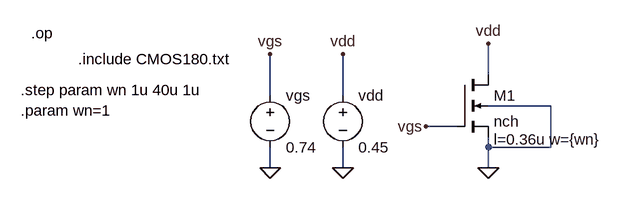
[diagram p0: schematic Draft1.asc]
Draft1.asc, the LTspice schematic file:
Version 4
SHEET 1 880 680
WIRE 208 112 208 64
WIRE -128 144 -128 80
WIRE -16 144 -16 80
WIRE 304 160 208 160
WIRE 160 192 112 192
WIRE 208 224 208 208
WIRE 304 224 304 160
WIRE 304 224 208 224
WIRE -128 256 -128 224
WIRE -16 256 -16 224
WIRE 208 256 208 224
FLAG 208 256 0
FLAG -128 256 0
FLAG -16 256 0
FLAG -128 80 vgs
FLAG -16 80 vdd
FLAG 208 64 vdd
FLAG 112 192 vgs
SYMBOL nmos4 160 112 R0
WINDOW 123 56 100 Left 2
SYMATTR Value2 l=0.36u w={wn}
SYMATTR InstName M1
SYMATTR Value nch
SYMBOL voltage -16 128 R0
WINDOW 123 0 0 Left 0
WINDOW 39 0 0 Left 0
SYMATTR InstName vdd
SYMATTR Value 0.45
SYMBOL voltage -128 128 R0
WINDOW 123 0 0 Left 0
WINDOW 39 0 0 Left 0
SYMATTR InstName vgs
SYMATTR Value 0.74
TEXT -424 88 Left 2 !.include CMOS180.txt
TEXT -512 136 Left 2 !.step param wn 1u 40u 1u\n.param wn=1
TEXT -496 48 Left 2 !.op

The netlist it stands for:
* Draft1.asc
M1 vdd vgs 0 0 nch l=0.36u w={wn}
vdd vdd 0 0.45
vgs vgs 0 0.74
.model NMOS NMOS
.model PMOS PMOS
.lib standard.mos
.include CMOS180.txt
.step param wn 1u 40u 1u
.param wn=1
.op
.backanno
.end

* Results of the author's LTspice run, read from the files saved beside the schematic
* From the log:
*   Semiconductor Device Operating Points:
*                           --- BSIM3 MOSFETS ---
*   Name:        m1
*   Model:       nch
*   Id:        2.69e-05
*   Vgs:       7.40e-01
*   Vds:       4.50e-01
*   Vbs:       0.00e+00
*   Vth:       4.60e-01
*   Vdsat:     2.02e-01
*   Gm:        1.84e-04
*   Gds:       4.21e-06
*   Gmb        4.71e-05
*   Cbd:       0.00e+00
*   Cbs:       0.00e+00
*   Cgsov:     4.91e-16
*   Cgdov:     4.91e-16
*   Cgbov:     3.28e-19
*   dQgdVgb:   3.33e-15
*   dQgdVdb:  -4.81e-16
*   dQgdVsb:  -2.70e-15
*   dQddVgb:  -5.05e-16
*   dQddVdb:   5.04e-16
*   dQddVsb:   5.20e-18
*   dQbdVgb:  -5.02e-16
*   dQbdVdb:  -3.23e-18
*   dQbdVsb:  -1.99e-16